# EAGLE design RotaryTable_RevA (EAGLE 7.6.0)

## Sheet 1 of 2
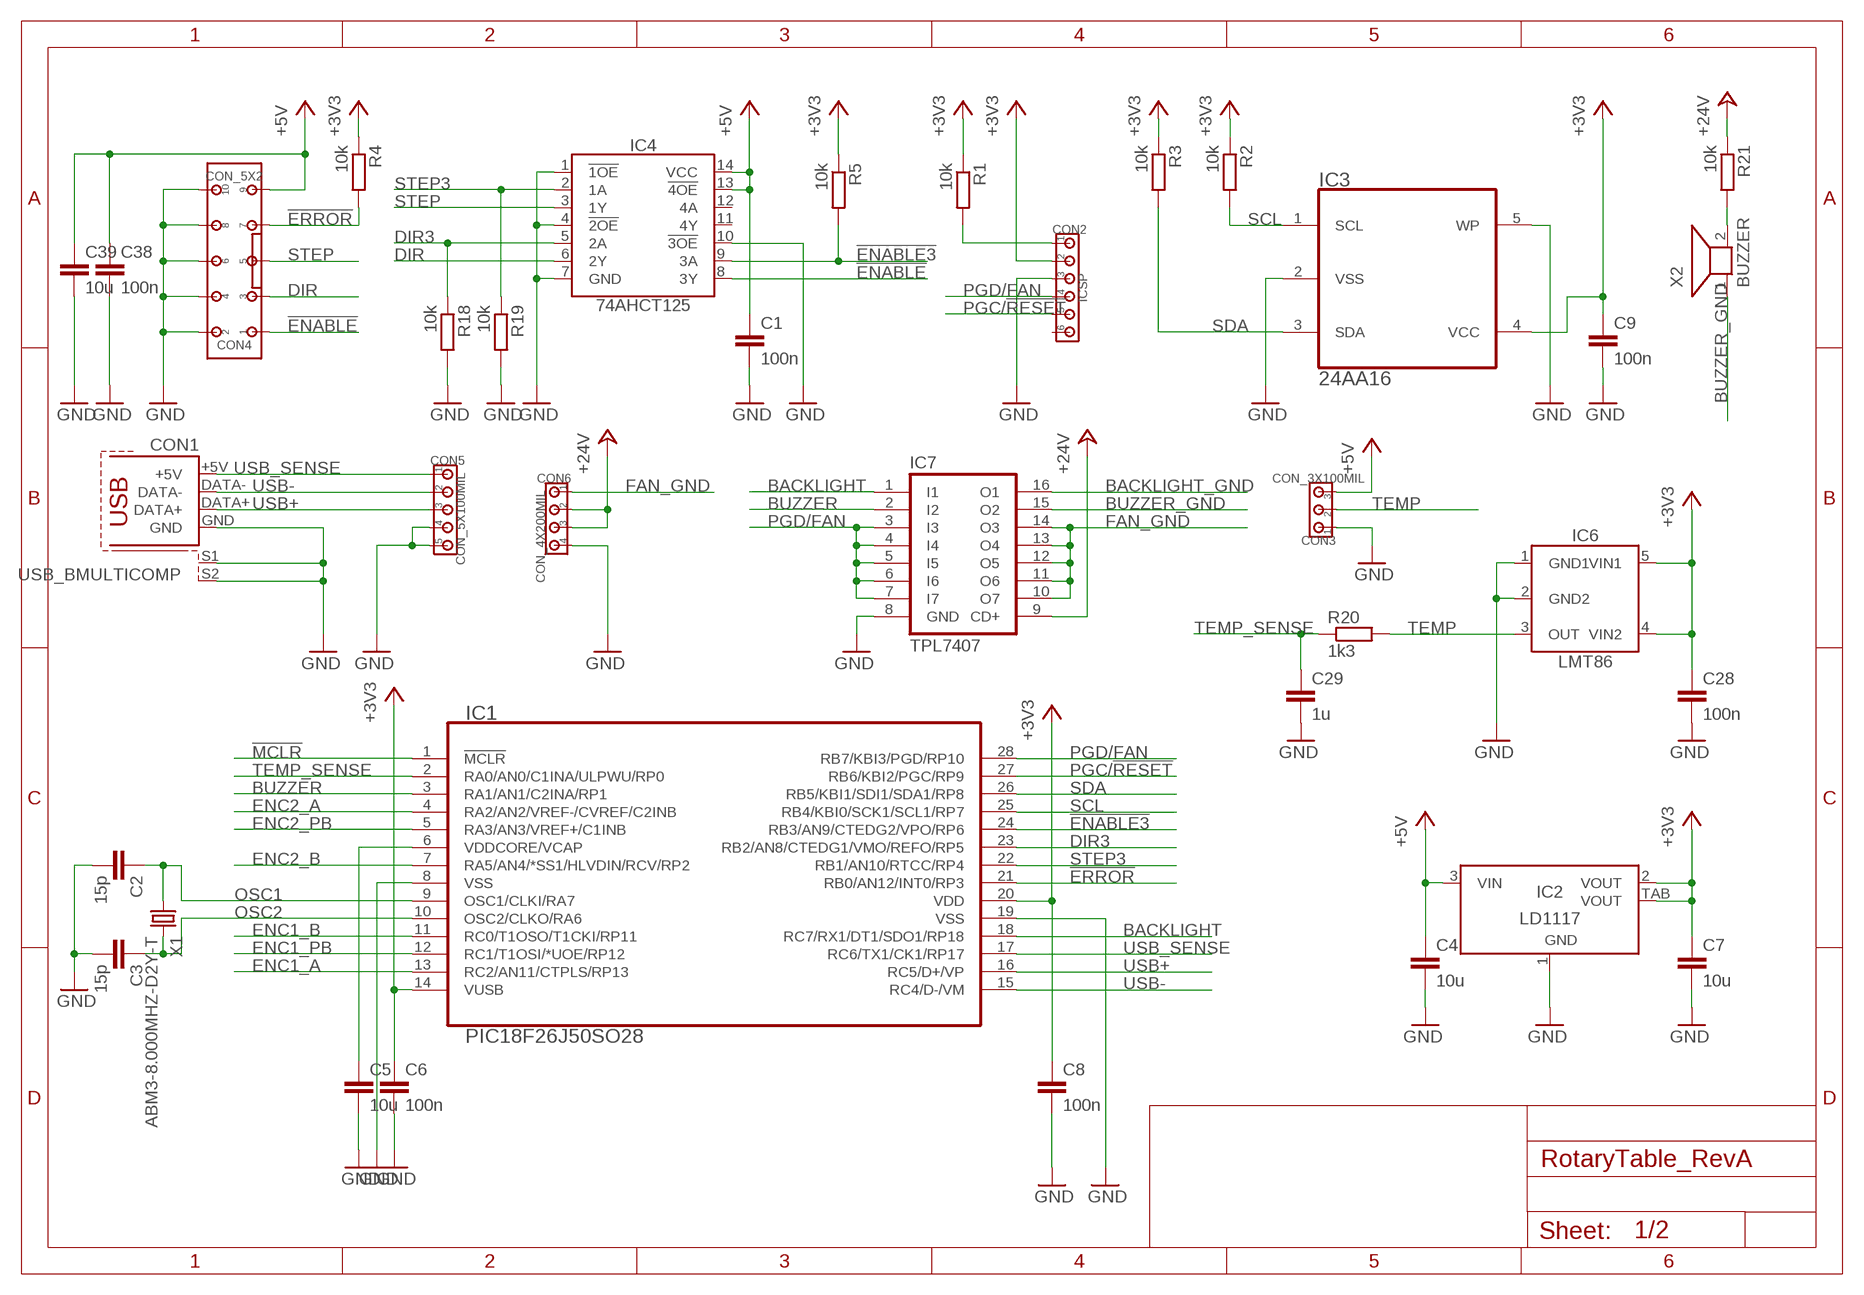
[diagram p0: schematic, sheet 1]

### Parts
C1  100n  CC0805  [C0805]
C2  15p  CC0805  [C0805]
C3  15p  CC0805  [C0805]
C4  10u  CC0805  [C0805]
C5  10u  CC0805  [C0805]
C6  100n  CC0805  [C0805]
C7  10u  CC0805  [C0805]
C8  100n  CC0805  [C0805]
C9  100n  CC0805  [C0805]
C28  100n  CC0805  [C0805]
C29  1u  CC0805  [C0805]
C38  100n  CC0805  [C0805]
C39  10u  CC0805  [C0805]
CON1  USB_BMULTICOMP  [USB_B]
CON2  ICSP  CON_6X100MIL  [100MIL_6X]
CON3  CON_3X100MIL  [100MIL_3X]
CON4  CON_5X2  [100MIL_5X2]
CON5  CON_5X100MIL  [100MIL_5X]
CON6  CON_4X200MIL  [200MIL_4X]
IC1  PIC18F26J50SO28  [SO28W]
IC2  LD1117  [SOT223]
IC3  24AA16  [SOT-23-5]
IC4  74AHCT125  74HC125  [SO14]
IC6  LMT86  [SC70-5]
IC7  TPL7407  ULN2003  [SO16]
R1  10k  RESISTORR0805  [R0805]
R2  10k  RESISTORR0805  [R0805]
R3  10k  RESISTORR0805  [R0805]
R4  10k  RESISTORR0805  [R0805]
R5  10k  RESISTORR0805  [R0805]
R18  10k  RESISTORR0805  [R0805]
R19  10k  RESISTORR0805  [R0805]
R20  1k3  RESISTORR0805  [R0805]
R21  10k  RESISTORR0805  [R0805]
X1  ABM3-8.000MHZ-D2Y-T  CRYSTAL5X3.2MM  [5X3.2MM]
X2  BUZZER  [BUZZER_14MM]

### Nets
!ENABLE3!: IC1.24(RB3/AN9/CTEDG2/VPO/RP6) IC4.9(3A) R5.2
!ENABLE!: CON4.1 IC4.8(3Y)
!ERROR!: CON4.7 IC1.21(RB0/AN12/INT0/RP3) R4.2
!MCLR!: CON2.1 IC1.1(!MCLR!) R1.2
+3V3: C6.1 C7.1 C8.1 C9.1 C28.1 CON2.2 IC1.14(VUSB) IC1.20(VDD) IC2.2(VOUT) IC2.TAB(VOUT) IC3.4(VCC) IC6.4(VIN2) IC6.5(VIN1) R1.1 R2.1 R3.1 R4.1 R5.1 ; also sheet 2
+5V: C1.1 C4.1 C38.1 C39.1 CON3.3 CON4.9 IC2.3(VIN) IC4.13(!4OE!) IC4.14(VCC) ; also sheet 2
+24V [24V]: CON6.2 CON6.3 IC7.9(CD+) R21.1 ; also sheet 2
BACKLIGHT: IC1.18(RC7/RX1/DT1/SDO1/RP18) IC7.1(I1)
BACKLIGHT_GND: IC7.16(O1) ; also sheet 2
BUZZER: IC1.3(RA1/AN1/C2INA/RP1) IC7.2(I2)
BUZZER_GND: IC7.15(O2) X2.1
DIR: CON4.3 IC4.6(2Y)
DIR3: IC1.23(RB2/AN8/CTEDG1/VMO/REFO/RP5) IC4.5(2A) R18.1
ENC1_A: IC1.13(RC2/AN11/CTPLS/RP13) ; also sheet 2
ENC1_B: IC1.11(RC0/T1OSO/T1CKI/RP11) ; also sheet 2
ENC1_PB: IC1.12(RC1/T1OSI/*UOE/RP12) ; also sheet 2
ENC2_A: IC1.4(RA2/AN2/VREF-/CVREF/C2INB) ; also sheet 2
ENC2_B: IC1.7(RA5/AN4/*SS1/HLVDIN/RCV/RP2) ; also sheet 2
ENC2_PB: IC1.5(RA3/AN3/VREF+/C1INB) ; also sheet 2
FAN_GND: CON6.1 IC7.10(O7) IC7.11(O6) IC7.12(O5) IC7.13(O4) IC7.14(O3)
GND: C1.2 C2.2 C3.2 C4.2 C5.2 C6.2 C7.2 C8.2 C9.2 C28.2 C29.2 C38.2 C39.2 CON1.GND CON1.S1 CON1.S2 CON2.3 CON3.1 CON4.2 CON4.4 CON4.6 CON4.8 CON4.10 CON5.4 CON5.5 CON6.4 IC1.8(VSS) IC1.19(VSS) IC2.1(GND) IC3.2(VSS) IC3.5(WP) IC4.1(!1OE!) IC4.4(!2OE!) IC4.7(GND) IC4.10(!3OE!) IC6.1(GND1) IC6.2(GND2) IC7.8(GND) R18.2 R19.2 ; also sheet 2
N$1: C5.1 IC1.6(VDDCORE/VCAP)
N$4: R21.2 X2.2
OSC1: C2.1 IC1.9(OSC1/CLKI/RA7) X1.1
OSC2: C3.1 IC1.10(OSC2/CLKO/RA6) X1.2
PGC/!RESET!: CON2.5 IC1.27(RB6/KBI2/PGC/RP9) ; also sheet 2
PGD/FAN: CON2.4 IC1.28(RB7/KBI3/PGD/RP10) IC7.3(I3) IC7.4(I4) IC7.5(I5) IC7.6(I6) IC7.7(I7)
SCL: IC1.25(RB4/KBI0/SCK1/SCL1/RP7) IC3.1(SCL) R2.2 ; also sheet 2
SDA: IC1.26(RB5/KBI1/SDI1/SDA1/RP8) IC3.3(SDA) R3.2 ; also sheet 2
STEP: CON4.5 IC4.3(1Y)
STEP3: IC1.22(RB1/AN10/RTCC/RP4) IC4.2(1A) R19.1
TEMP: CON3.2 IC6.3(OUT) R20.2
TEMP_SENSE: C29.1 IC1.2(RA0/AN0/C1INA/ULPWU/RP0) R20.1
USB+: CON1.DATA+ CON5.3 IC1.16(RC5/D+/VP)
USB-: CON1.DATA- CON5.2 IC1.15(RC4/D-/VM)
USB_SENSE: CON1.+5V CON5.1 IC1.17(RC6/TX1/CK1/RP17)
Unconnected: CON2.6 IC4.11(4Y) IC4.12(4A)

## Sheet 2 of 2
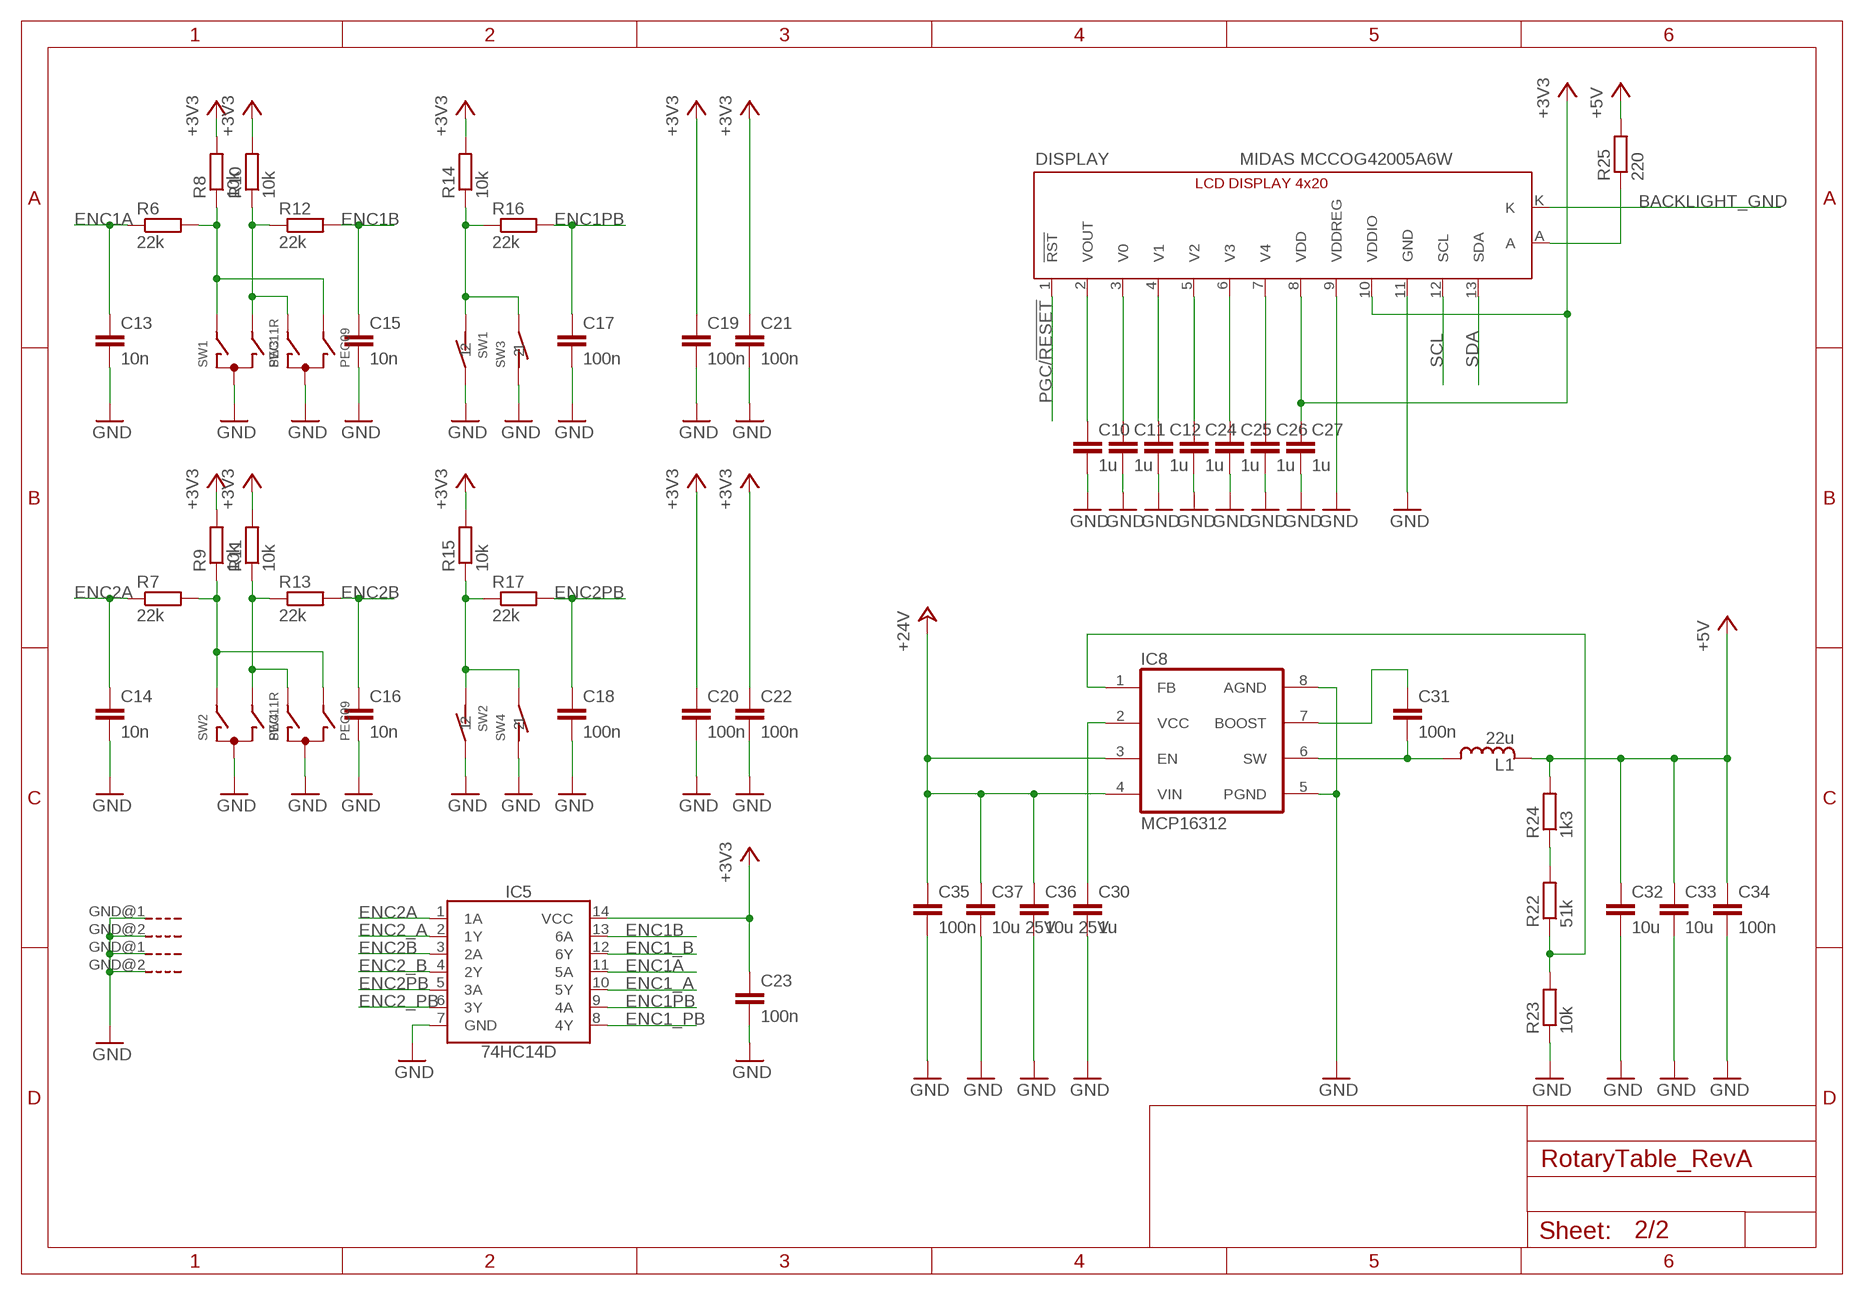
[diagram p1: schematic, sheet 2]

### Parts
C10  1u  CC0805  [C0805]
C11  1u  CC0805  [C0805]
C12  1u  CC0805  [C0805]
C13  10n  CC0805  [C0805]
C14  10n  CC0805  [C0805]
C15  10n  CC0805  [C0805]
C16  10n  CC0805  [C0805]
C17  100n  CC0805  [C0805]
C18  100n  CC0805  [C0805]
C19  100n  CC0805  [C0805]
C20  100n  CC0805  [C0805]
C21  100n  CC0805  [C0805]
C22  100n  CC0805  [C0805]
C23  100n  CC0805  [C0805]
C24  1u  CC0805  [C0805]
C25  1u  CC0805  [C0805]
C26  1u  CC0805  [C0805]
C27  1u  CC0805  [C0805]
C30  1u  CC0805  [C0805]
C31  100n  CC0805  [C0805]
C32  10u  CC0805  [C0805]
C33  10u  CC0805  [C0805]
C34  100n  CC0805  [C0805]
C35  100n  CC0805  [C0805]
C36  10u 25V  CC1206  [C1206]
C37  10u 25V  CC1206  [C1206]
DISPLAY  MIDAS MCCOG42005A6W  LCD4X20_I2C  [LCD_4X20_I2C]
IC5  74HC14D  [SO14]
IC8  MCP16312  MCP16311  [MSOP8]
L1  22u  INDUCTORSRN5040  [SRN5040]
R6  22k  RESISTORR0805  [R0805]
R7  22k  RESISTORR0805  [R0805]
R8  10k  RESISTORR0805  [R0805]
R9  10k  RESISTORR0805  [R0805]
R10  10k  RESISTORR0805  [R0805]
R11  10k  RESISTORR0805  [R0805]
R12  22k  RESISTORR0805  [R0805]
R13  22k  RESISTORR0805  [R0805]
R14  10k  RESISTORR0805  [R0805]
R15  10k  RESISTORR0805  [R0805]
R16  22k  RESISTORR0805  [R0805]
R17  22k  RESISTORR0805  [R0805]
R22  51k  RESISTORR0805  [R0805]
R23  10k  RESISTORR0805  [R0805]
R24  1k3  RESISTORR0805  [R0805]
R25  220  RESISTORR0805  [R0805]
SW1  PEC11R  ENCODER_BOURNS  [ENCODER_BOURNS]
SW2  PEC11R  ENCODER_BOURNS  [ENCODER_BOURNS]
SW3  PEC09  [PEC09]
SW4  PEC09  [PEC09]

### Nets
+3V3: C19.1 C20.1 C21.1 C22.1 C23.1 C27.1 DISPLAY.8(VDD) DISPLAY.10(VDDIO) IC5.14(VCC) R8.2 R9.2 R10.2 R11.2 R14.2 R15.2 ; also sheet 1
+5V: C32.1 C33.1 C34.1 L1.2 R24.2 R25.2 ; also sheet 1
+24V [24V]: C35.1 C36.1 C37.1 IC8.3(EN) IC8.4(VIN) ; also sheet 1
BACKLIGHT_GND: DISPLAY.K ; also sheet 1
ENC1_A: IC5.10(5Y) ; also sheet 1
ENC1_B: IC5.12(6Y) ; also sheet 1
ENC1_PB: IC5.8(4Y) ; also sheet 1
ENC1A: C13.1 IC5.11(5A) R6.1
ENC1B: C15.1 IC5.13(6A) R12.2
ENC1PB: C17.1 IC5.9(4A) R16.2
ENC2_A: IC5.2(1Y) ; also sheet 1
ENC2_B: IC5.4(2Y) ; also sheet 1
ENC2_PB: IC5.6(3Y) ; also sheet 1
ENC2A: C14.1 IC5.1(1A) R7.1
ENC2B: C16.1 IC5.3(2A) R13.2
ENC2PB: C18.1 IC5.5(3A) R17.2
GND: C10.2 C11.2 C12.2 C13.2 C14.2 C15.2 C16.2 C17.2 C18.2 C19.2 C20.2 C21.2 C22.2 C23.2 C24.2 C25.2 C26.2 C27.2 C30.2 C32.2 C33.2 C34.2 C35.2 C36.2 C37.2 DISPLAY.9(VDDREG) DISPLAY.11(GND) IC5.7(GND) IC8.5(PGND) IC8.8(AGND) R23.1 SW1.2 SW1.C SW1.GND@1(G) SW1.GND@2(G) SW2.2 SW2.C SW2.GND@1(G) SW2.GND@2(G) SW3.C SW3.D SW4.C SW4.D ; also sheet 1
N$2: C31.2 IC8.6(SW) L1.1
N$5: C30.1 IC8.2(VCC)
N$6: IC8.1(FB) R22.1 R23.2
N$8: C31.1 IC8.7(BOOST)
N$11: R22.2 R24.1
N$12: R15.1 R17.1 SW2.1 SW4.E
N$13: R10.1 R12.1 SW1.B SW3.A
N$14: R6.2 R8.1 SW1.A SW3.B
N$15: DISPLAY.A R25.1
N$17: R7.2 R9.1 SW2.A SW4.B
N$19: R14.1 R16.1 SW1.1 SW3.E
N$20: R11.1 R13.1 SW2.B SW4.A
N$25: C10.1 DISPLAY.2(VOUT)
N$26: C11.1 DISPLAY.3(V0)
N$27: C26.1 DISPLAY.7(V4)
N$28: C25.1 DISPLAY.6(V3)
N$29: C24.1 DISPLAY.5(V2)
N$30: C12.1 DISPLAY.4(V1)
PGC/!RESET!: DISPLAY.1(!RST!) ; also sheet 1
SCL: DISPLAY.12(SCL) ; also sheet 1
SDA: DISPLAY.13(SDA) ; also sheet 1

## Library data of the parts
C1-C39 = 00Capacitor:C: Capacitor
CON1 = 00Connector:USB_B: Type B USB connector
CON2 = 00Connector:CON_6X: 6-pin header
CON3 = 00Connector:CON_3X: 3-pin header
CON4 = 00Connector:CON_5X2
CON5 = 00Connector:CON_5X: 5-pin header
CON6 = 00Connector:CON_4X: 4-pin header
DISPLAY = 00Display:LCD4X20_I2C: 4x20 character LCD display with I2C interface
IC1 = 00PIC:PIC18F*J50: PIC18F Series 28-Pin Microcontroller; MEMORY: 64k
IC2 = 00VoltageRegulator:LD1117: Positive Voltage Regulator 800mA
IC3 = 00Logic:24AA16: 16K I2C Serial EEPROM
IC4 = 00Logic:74HC125: Quad buffer/line driver; 3-state
IC5 = 00Logic:74HC14: Hex Inverter Schmitt Trigger
IC6 = 00Sensor:LMT86: Analog Temperature Sensors with Class-AB Output
IC7 = 00Transistor:ULN2003: Seven Darlington array
IC8 = 00VoltageRegulator:MCP16311
L1 = 00Inductor:INDUCTOR
R1-R25 = 00Resistor:RESISTOR: RESISTOR, European symbol
SW1 SW2 = 00Switch:ENCODER_BOURNS: Bourns Rotary Encoder with Switch PEC11-4xxxF-Sxxxx
SW3 SW4 = 00Switch:PEC09
X1 = 00Crystal:CRYSTAL: Crystal
X2 = 00MyParts:BUZZER

## Net classes
1 24V: clearance 0.305 mm

## Board
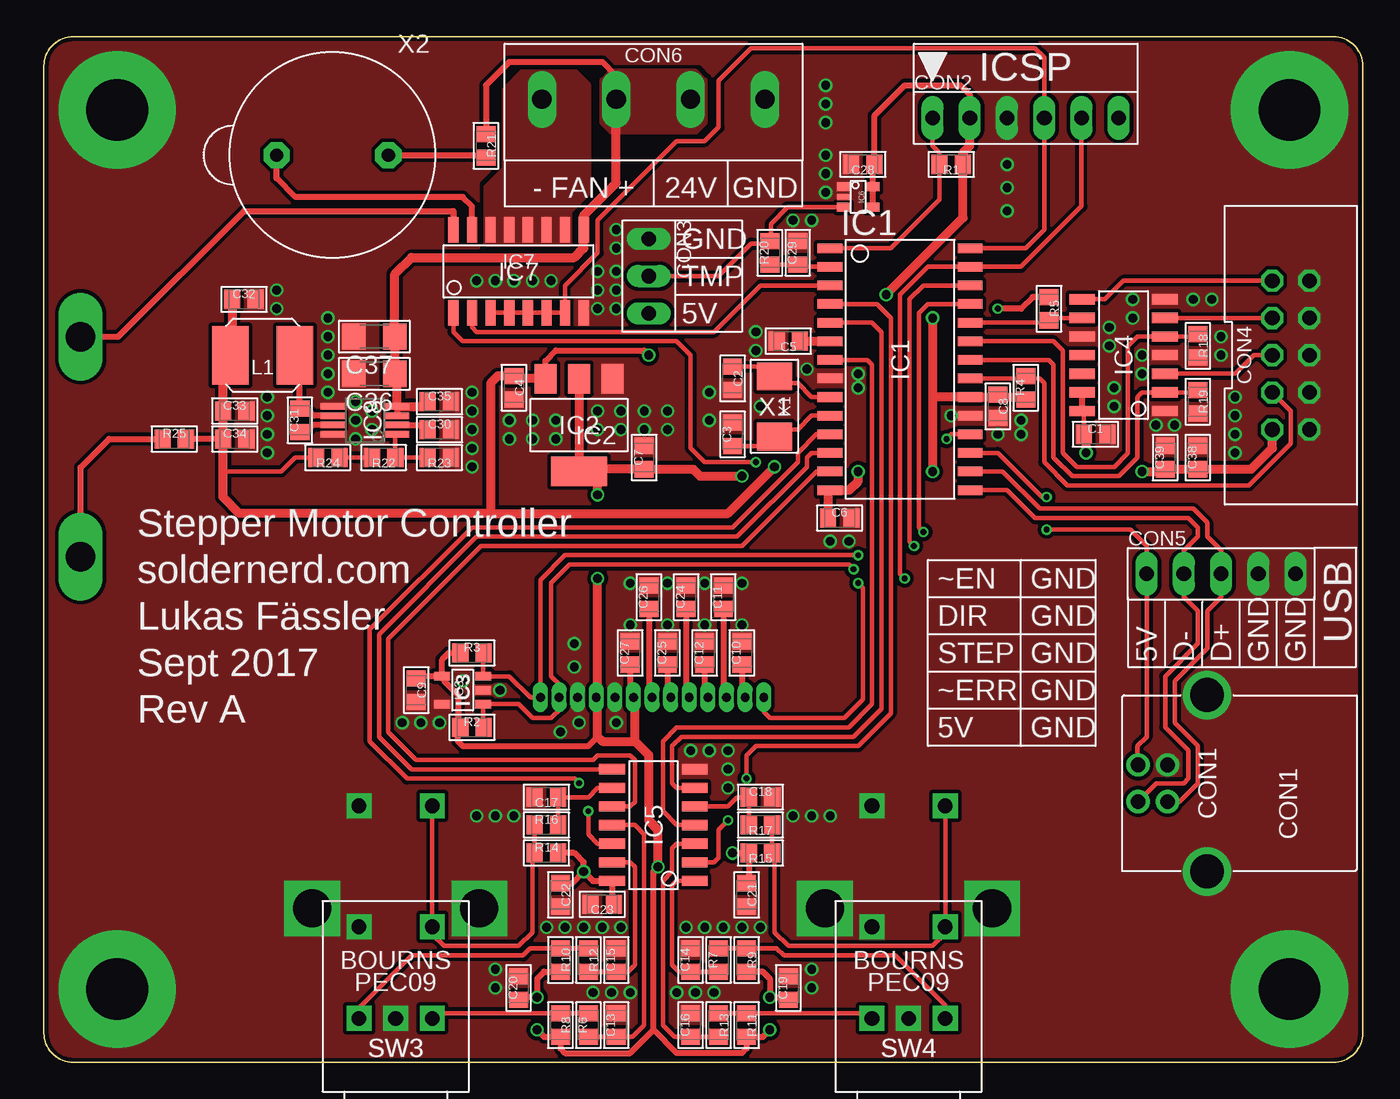
[diagram p2: board, top side]
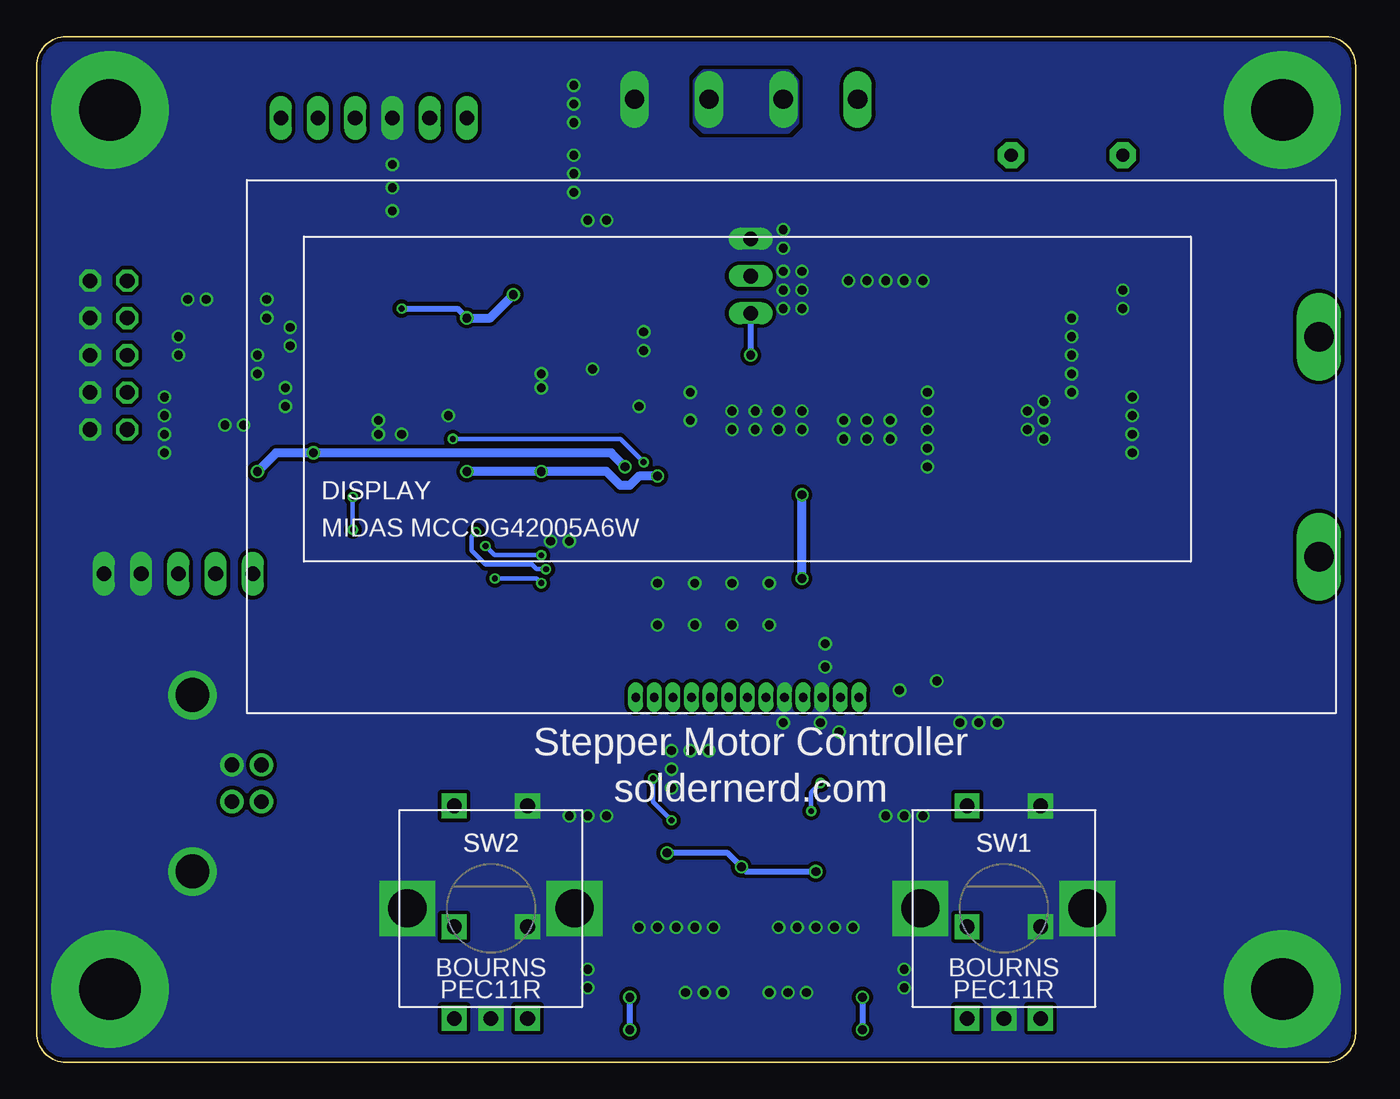
[diagram p3: board, bottom side, seen from below]

Size 90 x 70 mm. Coordinates in mm from the lower left corner, seen from the top.
Outline: 88,0 arc90 90,2 90,68 arc90 88,70 2,70 arc90 0,68 0,2 arc90 2,0 88,0
Copper layers (1*16): Top 0.035mm / dielectric 1.5mm / Bottom 0.035mm
Design rules "dirt_cheap_dirty_boards.8mil": minimum track width 5mil, minimum drill 12mil, track to track 8mil, track to pad 8mil, pad to pad 8mil, via to via 8mil, smd to smd 0mil, copper to edge 10mil, drill to drill 10mil, minimum pad ring 8mil, minimum via ring 6mil, stop-mask expansion 2mil, vias tented up to drill 25mil, thermal gap 10mil

### Footprints (pad centres in the part's own frame; a part is rotated, then mirrored left to right if it is on the bottom)
C0805 = smd 1.1 x 1.3: 1 -0.8,0; 2 0.8,0
C1206 = smd 1.6 x 1.8: 1 -1.4,0; 2 1.4,0
USB_B = drill 1 pad 1.6: +5V 1.25,4.71; DATA+ -1.25,2.71; DATA- -1.25,4.71; GND 1.25,2.71 | drill 2.3 pad 3: S1 -6.02,0; S2 6.02,0
100MIL_6X = drill 1 long: 1 -6.35,0; 2 -3.81,0; 3 -1.27,0; 4 1.27,0; 5 3.81,0; 6 6.35,0
100MIL_3X = drill 1 long: 1 -2.54,0; 2 0,0; 3 2.54,0
100MIL_5X2 = drill 1 octagon: 1 5.08,1.27; 2 5.08,-1.27; 3 2.54,1.27; 4 2.54,-1.27; 5 0,1.27; 6 0,-1.27; 7 -2.54,1.27; 8 -2.54,-1.27; 9 -5.08,1.27; 10 -5.08,-1.27
100MIL_5X = drill 1 long: 1 -5.08,0; 2 -2.54,0; 3 0,0; 4 2.54,0; 5 5.08,0
200MIL_4X = drill 1.3 long: 1 -7.62,0; 2 -2.54,0; 3 2.54,0; 4 7.62,0
LCD_4X20_I2C = drill 0.6 pad 0.9 long: 1 26.53,1.1; 2 27.8,1.1; 3 29.07,1.1; 4 30.34,1.1; 5 31.61,1.1; 6 32.88,1.1; 7 34.15,1.1; 8 35.42,1.1; 9 36.69,1.1; 10 37.96,1.1; 11 39.23,1.1; 12 40.5,1.1; 13 41.77,1.1 | drill 2 long: A 73.15,10.7; K 73.15,25.7
SO28W = smd 0.65 x 1.7: 1 -7.62,-4.78; 2 -6.35,-4.78; 3 -5.08,-4.78; 4 -3.81,-4.78; 5 -2.54,-4.78; 6 -1.27,-4.78; 7 0,-4.78; 8 1.27,-4.78; 9 2.54,-4.78; 10 3.81,-4.78; 11 5.08,-4.78; 12 6.35,-4.78; 13 7.62,-4.78; 14 8.89,-4.78; 15 8.89,4.78; 16 7.62,4.78; 17 6.35,4.78; 18 5.08,4.78; 19 3.81,4.78; 20 2.54,4.78; 21 1.27,4.78; 22 0,4.78; 23 -1.27,4.78; 24 -2.54,4.78; 25 -3.81,4.78; 26 -5.08,4.78; 27 -6.35,4.78; 28 -7.62,4.78
SOT223 = smd 1.5 x 2: 1 -2.3,-3.15; 2 0,-3.15; 3 2.3,-3.15 | smd 3.8 x 2: TAB 0,3.15
SOT-23-5 = smd 0.6 x 1.1: 1 -0.95,-1.4; 2 0,-1.4; 3 0.95,-1.4; 4 0.95,1.4; 5 -0.95,1.4
SO14 = smd 0.7 x 1.75: 1 -3.81,-2.825; 2 -2.54,-2.825; 3 -1.27,-2.825; 4 0,-2.825; 5 1.27,-2.825; 6 2.54,-2.825; 7 3.81,-2.825; 8 3.81,2.825; 9 2.54,2.825; 10 1.27,2.825; 11 0,2.825; 12 -1.27,2.825; 13 -2.54,2.825; 14 -3.81,2.825
SC70-5 = smd 0.6 x 0.9: 1 -0.7,-1; 3 0.7,-1; 4 0.7,1; 5 -0.7,1 | smd 0.4 x 0.9: 2 0,-1
SO16 = smd 0.7 x 1.75: 1 -4.445,-2.825; 2 -3.175,-2.825; 3 -1.905,-2.825; 4 -0.635,-2.825; 5 0.635,-2.825; 6 1.905,-2.825; 7 3.175,-2.825; 8 4.445,-2.825; 9 4.445,2.825; 10 3.175,2.825; 11 1.905,2.825; 12 0.635,2.825; 13 -0.635,2.825; 14 -1.905,2.825; 15 -3.175,2.825; 16 -4.445,2.825
MSOP8 = smd 1.65 x 0.45: 1 -2.2,0.953; 2 -2.2,0.318; 3 -2.2,-0.318; 4 -2.2,-0.953; 5 2.2,-0.953; 6 2.2,-0.318; 7 2.2,0.318; 8 2.2,0.953
SRN5040 = smd 2.5 x 4: 1 -2.2,0; 2 2.2,0
R0805 = smd 1.1 x 1.3: 1 -0.8,0; 2 0.8,0
ENCODER_BOURNS = drill 1 pad 1.7 square: 1 -2.5,7; 2 2.5,7; A -2.5,-7.5; B 2.5,-7.5; C 0,-7.5 | drill 2.6 pad 3.8 square: GND@1 -5.7,0; GND@2 5.7,0
PEC09 = drill 1 pad 1.7 square: A -2.5,0; B 2.5,0; C 0,0; D -2.5,6.25; E 2.5,6.25
5X3.2MM = smd 1.9 x 2.4: 1 -2.05,0; 2 2.05,0
BUZZER_14MM = drill 0.9 pad 1.8 octagon: 1 -3.81,0; 2 3.81,0

### Placement (x,y rotation side)
C1  71.75,42.86 0 top
C2  46.99,46.67 270 top
C3  46.99,42.86 90 top
C4  32.07,46.04 270 top
C5  50.8,49.21 180 top
C6  54.29,37.15 0 top
C7  40.96,41.27 90 top
C8  65.09,44.77 270 top
C9  25.4,25.4 270 top
C10  47.62,27.94 90 top
C11  46.35,31.75 90 top
C12  45.09,27.94 90 top
C13  39.05,2.54 90 top
C14  44.13,6.99 90 top
C15  39.05,6.99 90 top
C16  44.13,2.54 90 top
C17  34.29,18.1 180 top
C18  48.9,18.1 0 top
C19  50.8,5.08 90 top
C20  32.38,5.08 90 top
C21  47.94,11.43 270 top
C22  35.24,11.43 270 top
C23  38.1,10.79 180 top
C24  43.81,31.75 90 top
C25  42.55,27.94 90 top
C26  41.27,31.75 90 top
C27  40.01,27.94 90 top
C28  55.88,61.28 180 top
C29  51.44,55.24 90 top
C30  26.99,43.18 0 top
C31  17.46,43.81 90 top
C32  13.65,52.07 0 top
C33  13.02,44.45 0 top
C34  13.02,42.55 0 top
C35  26.99,45.09 0 top
C36  22.54,46.99 180 top
C37  22.54,49.53 180 top
C38  78.74,41.27 90 top
C39  76.52,41.27 90 top
CON1  79.38,19.05 90 top
CON2  66.99,64.45 0 top
CON3  41.27,53.66 270 top
CON4  85.09,48.26 90 top
CON5  80.33,33.34 0 top
CON6  41.59,65.72 0 top
DISPLAY  75.65,23.81 0 bottom
IC1  58.42,47.94 270 top
IC2  36.51,43.5 180 top
IC3  28.57,25.4 90 top
IC4  73.66,48.26 90 top
IC5  41.59,16.19 90 top
IC6  55.56,59.05 270 top
IC7  32.38,53.98 0 top
IC8  21.91,43.81 180 top
L1  14.92,48.26 180 top
R1  61.91,61.28 180 top
R2  29.21,22.86 0 top
R3  29.21,27.94 0 top
R4  66.99,46.04 90 top
R5  68.58,51.44 270 top
R6  37.15,2.54 90 top
R7  46.04,6.99 90 top
R8  35.24,2.54 270 top
R9  47.94,6.99 270 top
R10  35.24,6.99 270 top
R11  47.94,2.54 270 top
R12  37.15,6.99 270 top
R13  46.04,2.54 270 top
R14  34.29,14.29 0 top
R15  48.9,14.29 180 top
R16  34.29,16.19 0 top
R17  48.9,16.19 180 top
R18  78.74,48.9 270 top
R19  78.74,45.09 270 top
R20  49.53,55.24 90 top
R21  30.16,62.55 270 top
R22  23.18,41.27 180 top
R23  26.99,41.27 180 top
R24  19.37,41.27 180 top
R25  8.89,42.55 0 top
SW1  24,10.5 0 bottom
SW2  59,10.5 0 bottom
SW3  24,3 0 top
SW4  59,3 0 top
X1  49.85,44.77 270 top
X2  19.68,61.91 0 top

### Tracks (layer width: path | path; a pad name or v marks a point on that pad's centre or on a via)
!ENABLE3!
  Top 0.305: IC4.9 68.75,50.8 R5.2 68.43,50.48 IC1.24
!ENABLE!
  Top 0.305: CON4.1 73.66,53.34 72.39,52.07 IC4.8
!ERROR!
  Top 0.305: IC1.21 66.99,46.67 | 66.99,46.67 67.94,46.67 68.26,46.35 68.26,40.96 69.85,39.37 82.23,39.37 85.09,42.23 85.09,44.45 CON4.7 | R4.2 66.99,46.67
!MCLR!
  Top 0.305: IC1.1 57.78,55.56 61.11,58.89 R1.2 61.11,62.08 60.64,62.55 CON2.1
+3V3  (via drill 0.4, 0.6)
  Top 0.305: 38.68,12.38 IC5.14
  Top 0.406: v49.53,2.22 49.05,1.74 R11.2 47.94,0.95 47.62,0.64 43.18,0.64 41.59,2.22 | v33.66,2.22 34.14,1.74 R8.2 35.24,0.95 35.56,0.64 40.01,0.64 41.59,2.22 | C20.1 32.55,4.45 v33.66,4.45 33.66,5.71 34.12,6.18 R10.2 | 35.09,12.38 C22.1 36.04,12.23 v36.83,13.02 | 41.59,2.22 41.59,13.02 v41.91,13.34 | v36.83,13.02 37.47,12.38 IC5.14 38.77,10.93 C23.1 | v36.83,13.02 36.83,13.65 36.2,14.29 R14.2 | v46.99,14.29 R15.2 48.09,12.38 C21.1 | R9.2 49.06,6.18 49.53,5.71 v49.53,4.45 50.63,4.45 C19.1 | 28.26,27.79 R3.1 27.62,27.94 27.18,27.49 IC3.4 | IC3.4 25.55,26.35 C9.1 | IC3.4 27.3,26.22 27.3,26.04 28.26,25.08 28.26,23.01 R2.1 28.26,22.71 28.26,21.91 28.57,21.59 37.15,21.59 37.78,22.23 | 37.78,24.82 DISPLAY.10 | C27.1 40.01,25.14 DISPLAY.8 | IC1.14 53.49,38.91 | R5.1 67.47,52.23 66.67,51.44 v65.09,51.44 | IC6.4 IC6.5 56.56,61.16 C28.1 56.68,64.62 58.74,66.67 62.55,66.67 63.18,66.04 CON2.2
  Top 0.61: v41.91,13.34 41.91,15.88 41.27,16.51 41.27,20.95 40.32,21.91 | 53.49,38.91 C6.1 | 60.64,45.4 IC1.20 65.09,45.4 | 60.64,45.4 v60.64,40.32 | IC1.14 54.93,39.05 55.56,39.69 v55.56,40.32 | v60.64,50.8 60.64,45.4 | IC2.2 IC2.TAB | v47.62,40.01 44.77,40.01 44.3,40.48 C7.1 36.51,40.48 IC2.TAB | v37.78,33.02 37.78,24.82 37.78,22.23 38.1,21.91 40.32,21.91 | IC2.TAB 36.54,40.32 | v37.78,38.73 37.78,40.35 IC2.TAB | v57.47,52.39 62.71,57.63 R1.1 62.71,62.08 63.18,62.55 CON2.2 | 65.09,45.4 66.83,45.4 R4.1 | C8.1 65.09,45.4 | 40.32,21.91 40.32,24.82 DISPLAY.8
  Bottom 0.406: v49.53,4.45 v49.53,2.22 | v33.66,4.45 v33.66,2.22 | v36.83,13.02 41.59,13.02 v41.91,13.34 42.86,14.29 v46.99,14.29 | v65.09,51.44 61.28,51.44 v60.64,50.8
  Bottom 0.61: v60.64,40.32 v55.56,40.32 51.12,40.32 50.16,39.37 49.53,39.37 48.9,40.01 v47.62,40.01 | v60.64,50.8 59.05,50.8 v57.47,52.39 | v37.78,33.02 v37.78,38.73
+5V  (via drill 0.6)
  Top 0.305: C1.1 70.95,44.45 IC4.14 | R24.2 17.14,41.27 16.19,40.32 12.22,40.32
  Top 0.406: IC4.13 IC4.14 70.95,44.33 | C34.1 R25.2 | IC2.3 34.21,47.87 34.92,48.58 40.96,48.58 v41.27,48.26
  Top 0.61: CON4.9 83.82,41.91 82.39,40.48 C38.1 C39.1 76.36,40.32 v74.93,40.32 | v71.12,41.59 71.12,42.7 C1.1 | IC2.3 32.26,46.65 C4.1 30.96,46.84 30.48,46.35 30.48,37.47 | 30.48,37.47 13.34,37.47 12.22,38.58 12.22,40.32 C34.1 C33.1 12.22,47.85 12.32,47.85 L1.2 12.85,48.39 C32.1 | 30.48,37.47 46.67,37.47 v49.85,40.64
  Bottom 0.406: CON3.3 v41.27,48.26
  Bottom 0.61: v74.93,40.32 73.66,41.59 v71.12,41.59 50.8,41.59 v49.85,40.64
+24V
  Top 0.406: 39.05,67.31 38.1,68.26 31.75,68.26 30.16,66.67 R21.1 | IC8.4 IC8.3
  Top 0.61: C35.1 25.87,44.77 IC8.4 24.11,46.83 C36.1 C37.1 23.94,53.79 25.08,54.93 36.2,54.93 36.83,55.56 IC7.9 36.83,57.78 39.05,60.01 CON6.2
  pour Top (isolate 0.305, no thermals): 38.73,67.63 44.45,67.63 45.09,66.99 45.09,64.14 44.45,63.5 38.73,63.5 38.1,64.14 38.1,66.99
  pour Bottom (isolate 0.305, no thermals): 38.73,67.63 44.45,67.63 45.09,66.99 45.09,64.14 44.45,63.5 38.73,63.5 38.1,64.14 38.1,66.99
BACKLIGHT  (via drill 0.4)
  Top 0.305: IC7.1 27.94,49.85 28.57,49.21 43.18,49.21 44.13,48.26 44.13,41.91 45.09,40.96 v48.58,40.96 | IC1.18 61.91,42.86 v61.59,42.55
  Bottom 0.305: v61.59,42.55 50.16,42.55 v48.58,40.96
BACKLIGHT_GND
  Top 0.406: DISPLAY.K 5.06,49.51 13.65,58.1 27.94,58.1 IC7.16 27.94,57.78
BUZZER
  Top 0.305: IC7.2 29.21,50.16 29.53,49.85 45.72,49.85 48.9,53.02 IC1.3
BUZZER_GND
  Top 0.406: IC7.15 29.21,58.42 28.57,59.05 17.14,59.05 15.88,60.33 X2.1
DIR
  Top 0.305: IC4.6 CON4.3
DIR3
  Top 0.305: R18.1 78.58,49.53 IC4.5 74.61,49.53 73.98,48.9 73.98,41.59 73.03,40.64 70.48,40.64 69.53,41.59 69.53,48.58 68.9,49.21 IC1.23
ENC1_A
  Top 0.305: IC5.10 40.01,17.46 40.32,17.78 40.32,20.64 40.01,20.95 37.78,20.95 37.47,20.64 25.4,20.64 23.5,22.54 23.5,28.89 29.84,35.24 47.62,35.24 52.7,40.32 IC1.13
ENC1_B  (via drill 0.4)
  Top 0.305: IC5.12 37.78,14.92 37.15,15.56 v37.15,17.14 | v36.51,19.05 36.2,19.37 24.77,19.37 22.23,21.91 22.23,29.53 29.21,36.51 46.99,36.51 51.44,40.96 51.44,41.59 52.7,42.86 IC1.11
  Bottom 0.305: v37.15,17.14 37.15,18.41 v36.51,19.05
ENC1_PB
  Top 0.305: IC5.8 25.08,20 22.86,22.23 22.86,29.21 29.53,35.88 47.31,35.88 52.07,40.64 52.07,41.27 52.39,41.59 IC1.12
ENC1A
  Top 0.305: R6.1 C13.1 40.16,1.74 40.96,2.54 40.96,15.56 40.32,16.19 IC5.11
ENC1B
  Top 0.305: R12.2 C15.1 39.84,6.18 40.32,6.67 40.32,13.34 40.01,13.65 IC5.13
ENC1PB
  Top 0.305: R16.2 C17.1 37.15,18.1 37.78,18.73 IC5.9
ENC2_A  (via drill 0.4)
  Top 0.305: IC5.2 45.72,13.65 46.04,13.97 46.04,15.88 v46.67,16.51 | IC1.4 56.83,51.75 57.78,50.8 57.78,23.81 55.56,21.59 48.58,21.59 47.94,20.95 v47.94,19.37
  Bottom 0.305: v46.67,16.51 47.94,17.78 v47.94,19.37
ENC2_B
  Top 0.305: IC5.4 43.18,16.19 42.23,17.14 42.23,21.91 43.18,22.86 54.93,22.86 56.52,24.45 56.52,47.62 56.2,47.94 IC1.7
ENC2_PB
  Top 0.305: IC5.6 43.18,18.73 42.86,19.05 42.86,21.59 43.5,22.23 55.24,22.23 57.15,24.13 57.15,49.85 56.52,50.48 IC1.5
ENC2A
  Top 0.305: R7.1 C14.1 43.34,6.18 42.86,6.67 42.86,12.06 43.18,12.38 IC5.1
ENC2B
  Top 0.305: R13.2 C16.1 43.03,1.74 42.23,2.54 42.23,12.38 42.86,13.02 42.86,14.61 43.18,14.92 IC5.3
ENC2PB
  Top 0.305: R17.2 C18.1 47.31,18.1 46.67,17.46 IC5.5
FAN_GND
  pour Top (isolate 0.305, rank 2, no thermals): 35.88,55.88 35.88,58.1 37.15,59.37 37.15,66.67 36.2,67.63 32.7,67.63 31.43,66.36 31.43,60.96 30.16,59.69 30.16,55.88
GND  (via drill 0.6, 4.2 pad 8)
  other vias: 5,5 85,5 5,65 85,65 38.1,9.21 39.37,9.21 40.01,4.76 43.81,9.21 45.09,9.21 43.18,4.76 38.73,4.76 44.45,4.76 32.07,16.83 30.8,16.83 53.66,16.83 52.39,16.83 34.29,9.21 35.56,9.21 46.67,18.73 52.39,5.08 46.67,20 51.12,16.83 46.35,9.21 36.83,9.21 29.53,16.83 45.72,4.76 37.47,4.76 36.51,23.18 39.05,23.18 52.39,6.35 46.67,21.27 30.8,6.35 30.8,5.08 44.13,21.27 45.4,21.27 48.9,9.21 47.62,9.21 52.07,47.31 55.56,46.99 55.56,46.04 45.4,45.72 45.4,43.81 48.9,44.77 48.58,49.85 48.58,48.58 65.09,42.86 61.91,44.13 66.67,43.81 66.67,42.86 45.09,29.84 42.55,29.84 40.01,32.7 40.01,29.84 42.55,32.7 45.09,32.7 47.62,32.7 47.62,29.84 28.57,26.04 31.11,25.4 53.66,35.56 54.93,35.56 29.21,45.72 29.21,44.45 29.21,43.18 29.21,41.91 29.21,40.64 15.24,45.4 15.24,44.13 15.24,42.86 15.24,41.59 15.88,52.7 15.88,51.44 19.37,50.8 19.37,49.53 19.37,48.26 19.37,46.99 19.37,45.72 31.75,43.81 31.75,42.55 33.34,43.81 37.78,44.45 39.37,44.45 40.96,44.45 42.55,43.18 42.55,44.45 37.78,43.18 39.37,43.18 40.96,43.18 34.92,42.55 34.92,43.81 33.34,42.55 24.45,23.18 25.72,23.18 26.99,23.18 36.2,28.57 36.2,26.99 35.24,22.54 53.34,61.91 53.34,60.64 53.34,59.37 51.12,57.47 52.39,57.47 81.28,41.59 77.15,43.5 75.88,43.5 73.03,44.77 73.03,46.04 81.28,42.86 81.28,44.13 81.28,45.4 80.33,48.26 80.33,49.53 79.69,52.07 78.42,52.07 74.3,52.07 74.3,50.8 74.93,48.26 74.93,46.99 72.71,48.9 72.71,50.16 53.34,66.67 53.34,65.41 53.34,64.14 65.72,61.28 65.72,59.69 65.72,58.1 39.05,56.83 39.05,55.56 39.05,53.98 37.78,53.98 37.78,52.7 39.05,52.7 39.05,51.44 37.78,51.44 21.27,45.09 21.27,43.81 21.27,42.55 22.38,44.45 22.38,43.18 29.53,53.34 30.8,53.34 32.07,53.34 33.34,53.34 34.61,53.34
  pour Bottom (isolate 0.254, rank 3, no thermals): 88,0 2,0 arc-90 0,2 0,68 arc-90 2,70 88,70 arc-90 90,68 90,2 arc-90
  pour Top (isolate 0.254, rank 3, no thermals): 0,2 0,68 arc-90 2,70 88,70 arc-90 90,68 90,2 arc-90 88,0 2,0 arc-90
N$1
  Top 0.61: C5.1 IC1.6
N$2
  Top 0.305: 17.93,44.62 C31.2
  Top 0.406: IC8.6 18.41,44.13 17.93,44.62 | C31.2 17.46,48.26 L1.1
N$4
  Top 0.406: X2.2 30,61.91 arc-90 R21.2
N$5
  Top 0.406: IC8.2 25.87,43.5 C30.1
N$6
  Top 0.305: R23.2 R22.1 23.98,42.86 IC8.1
N$8
  Top 0.305: 18.41,43.5 18.1,43.18 | 17.63,43.18 C31.1
  Top 0.406: IC8.7 18.41,43.5 | 18.1,43.18 17.63,43.18
N$11
  Top 0.305: R22.2 R24.1
N$12
  Top 0.305: SW2.1 SW4.E 61.5,8.79 60.64,7.94 50.8,7.94 49.85,8.89 49.85,14.13 R15.1 R17.1
N$13
  Top 0.305: R12.1 R10.1 33.19,7.79 32.7,7.3 25.08,7.3 21.5,3.72 SW3.A
N$14
  Top 0.305: R6.2 R8.1 | 35.24,3.32 R8.1 | R8.1 26.84,3.34 SW3.B
N$15
  Top 0.406: DISPLAY.A 2.5,40.6 4.45,42.55 R25.1
N$17
  Top 0.305: R7.2 R9.1 50,7.79 50.48,7.3 58.1,7.3 61.5,3.9 SW2.A
N$19
  Top 0.305: SW1.1 SW3.E 26.5,8.74 27.3,7.94 32.38,7.94 33.34,8.89 33.34,14.13 R14.1 R16.1
N$20
  Top 0.305: R13.1 R11.1 | 47.94,3.32 R11.1 | R11.1 56.16,3.34 SW2.B
N$25
  Top 0.406: C10.1 47.62,25.14 DISPLAY.2
N$26
  Top 0.406: C11.1 46.35,25.14 DISPLAY.3
N$27
  Top 0.406: C26.1 41.27,25.14 DISPLAY.7
N$28
  Top 0.406: C25.1 42.55,25.14 DISPLAY.6
N$29
  Top 0.406: C24.1 43.81,25.14 DISPLAY.5
N$30
  Top 0.406: C12.1 45.09,25.14 DISPLAY.4
OSC1
  Top 0.305: IC1.9 52.39,45.4 51.44,46.35 50.31,46.35 X1.1 49.19,47.47 C2.1
OSC2
  Top 0.305: IC1.10 52.39,44.13 51.44,43.18 50.31,43.18 X1.2 49.19,42.06 C3.1
PGC/!RESET!  (via drill 0.4)
  Top 0.305: v58.74,33.02 58.42,33.34 58.42,52.39 60.33,54.29 IC1.27 66.67,54.29 70.8,58.42 CON2.5 | DISPLAY.1 49.12,23.91 49.53,23.5 54.61,23.5 55.88,24.77 55.88,32.38 v55.56,32.7
  Bottom 0.305: v55.56,32.7 55.88,33.02 v58.74,33.02
PGD/FAN
  Top 0.305: IC7.3 IC7.4 IC7.5 IC7.6 IC7.7 35.56,53.02 37.78,55.24 37.78,57.47 43.18,62.87 45.09,62.87 46.04,63.82 46.04,66.99 48.26,69.22 67.63,69.22 68.26,68.58 CON2.4 68.26,56.83 66.99,55.56 IC1.28
SCL  (via drill 0.4)
  Top 0.305: IC1.25 60.33,51.75 59.69,51.12 59.69,36.51 v60.01,36.2 | v55.24,33.66 54.93,33.97 35.88,33.97 34.61,32.7 34.61,26.35 35.24,25.72 35.24,25 DISPLAY.12 35.24,24.82 35.24,24.13 34.61,23.5 33.34,23.5 32.38,24.45 IC3.1 29.98,22.89 R2.2
  Bottom 0.305: v55.24,33.66 55.88,33.66 56.2,33.97 59.37,33.97 60.33,34.92 60.33,35.88 v60.01,36.2
SDA  (via drill 0.4)
  Top 0.305: IC1.26 60.01,53.02 59.05,52.07 59.05,35.56 v59.37,35.24 | v55.56,34.61 35.56,34.61 33.88,32.93 DISPLAY.13 33.19,24.91 31.75,26.35 IC3.3 29.98,27.91 R3.2
  Bottom 0.305: v55.56,34.61 58.74,34.61 v59.37,35.24
STEP
  Top 0.305: IC4.3 81.28,46.99 82.55,48.26 CON4.5
STEP3
  Top 0.305: R19.1 78.58,45.72 IC4.2 74.93,45.72 74.61,45.4 74.61,41.27 73.34,40.01 70.17,40.01 68.9,41.27 68.9,47.62 68.58,47.94 IC1.22
TEMP
  Top 0.305: IC6.3 50.73,58.35 49.59,57.22 49.59,56.11 R20.2 49.37,55.88 48.26,55.88 46.04,53.66 CON3.2
TEMP_SENSE
  Top 0.305: IC1.2 51.59,54.29 C29.1 R20.1
USB+
  Top 0.305: IC1.16 65.41,40.32 67.94,37.78 78.42,37.78 79.38,36.83 79.38,35.88 80.33,34.92 CON5.3 80.33,31.75 79.38,30.8 79.38,28.26 77.15,26.04 77.15,23.18 78.74,21.59 78.74,19.05 77.47,17.78 76.69,17.78 CON1.DATA+
USB-
  Top 0.305: IC1.15 65.72,39.05 67.63,37.15 78.11,37.15 78.74,36.51 78.74,35.88 77.79,34.92 CON5.2 77.79,31.75 78.74,30.8 78.74,28.57 76.52,26.35 76.52,22.86 78.11,21.27 78.11,19.37 77.79,19.05 75.92,19.05 CON1.DATA-
USB_SENSE  (via drill 0.4)
  Top 0.305: IC1.17 65.09,41.59 68.1,38.58 v68.42,38.58 | v68.42,36.35 74.14,36.35 75.25,35.24 CON5.1 75.25,22.23 74.61,21.59 74.61,20.35 CON1.+5V
  Bottom 0.305: v68.42,38.58 v68.42,36.35

### Text on the board
tPlace: ICSP | - FAN + | 24V | GND | GND | TMP | 5V | Stepper Motor Controller | soldernerd.com | ~EN | GND | USB | Lukas Fässler | DIR | GND | STEP | GND | Sept 2017 | 5V | D- | D+ | GND | GND | ~ERR | GND | Rev A | 5V | GND
bPlace: Stepper Motor Controller | soldernerd.com